# EAGLE design 130818_I_T_V_AriloRX_0_2 (EAGLE 6.1)
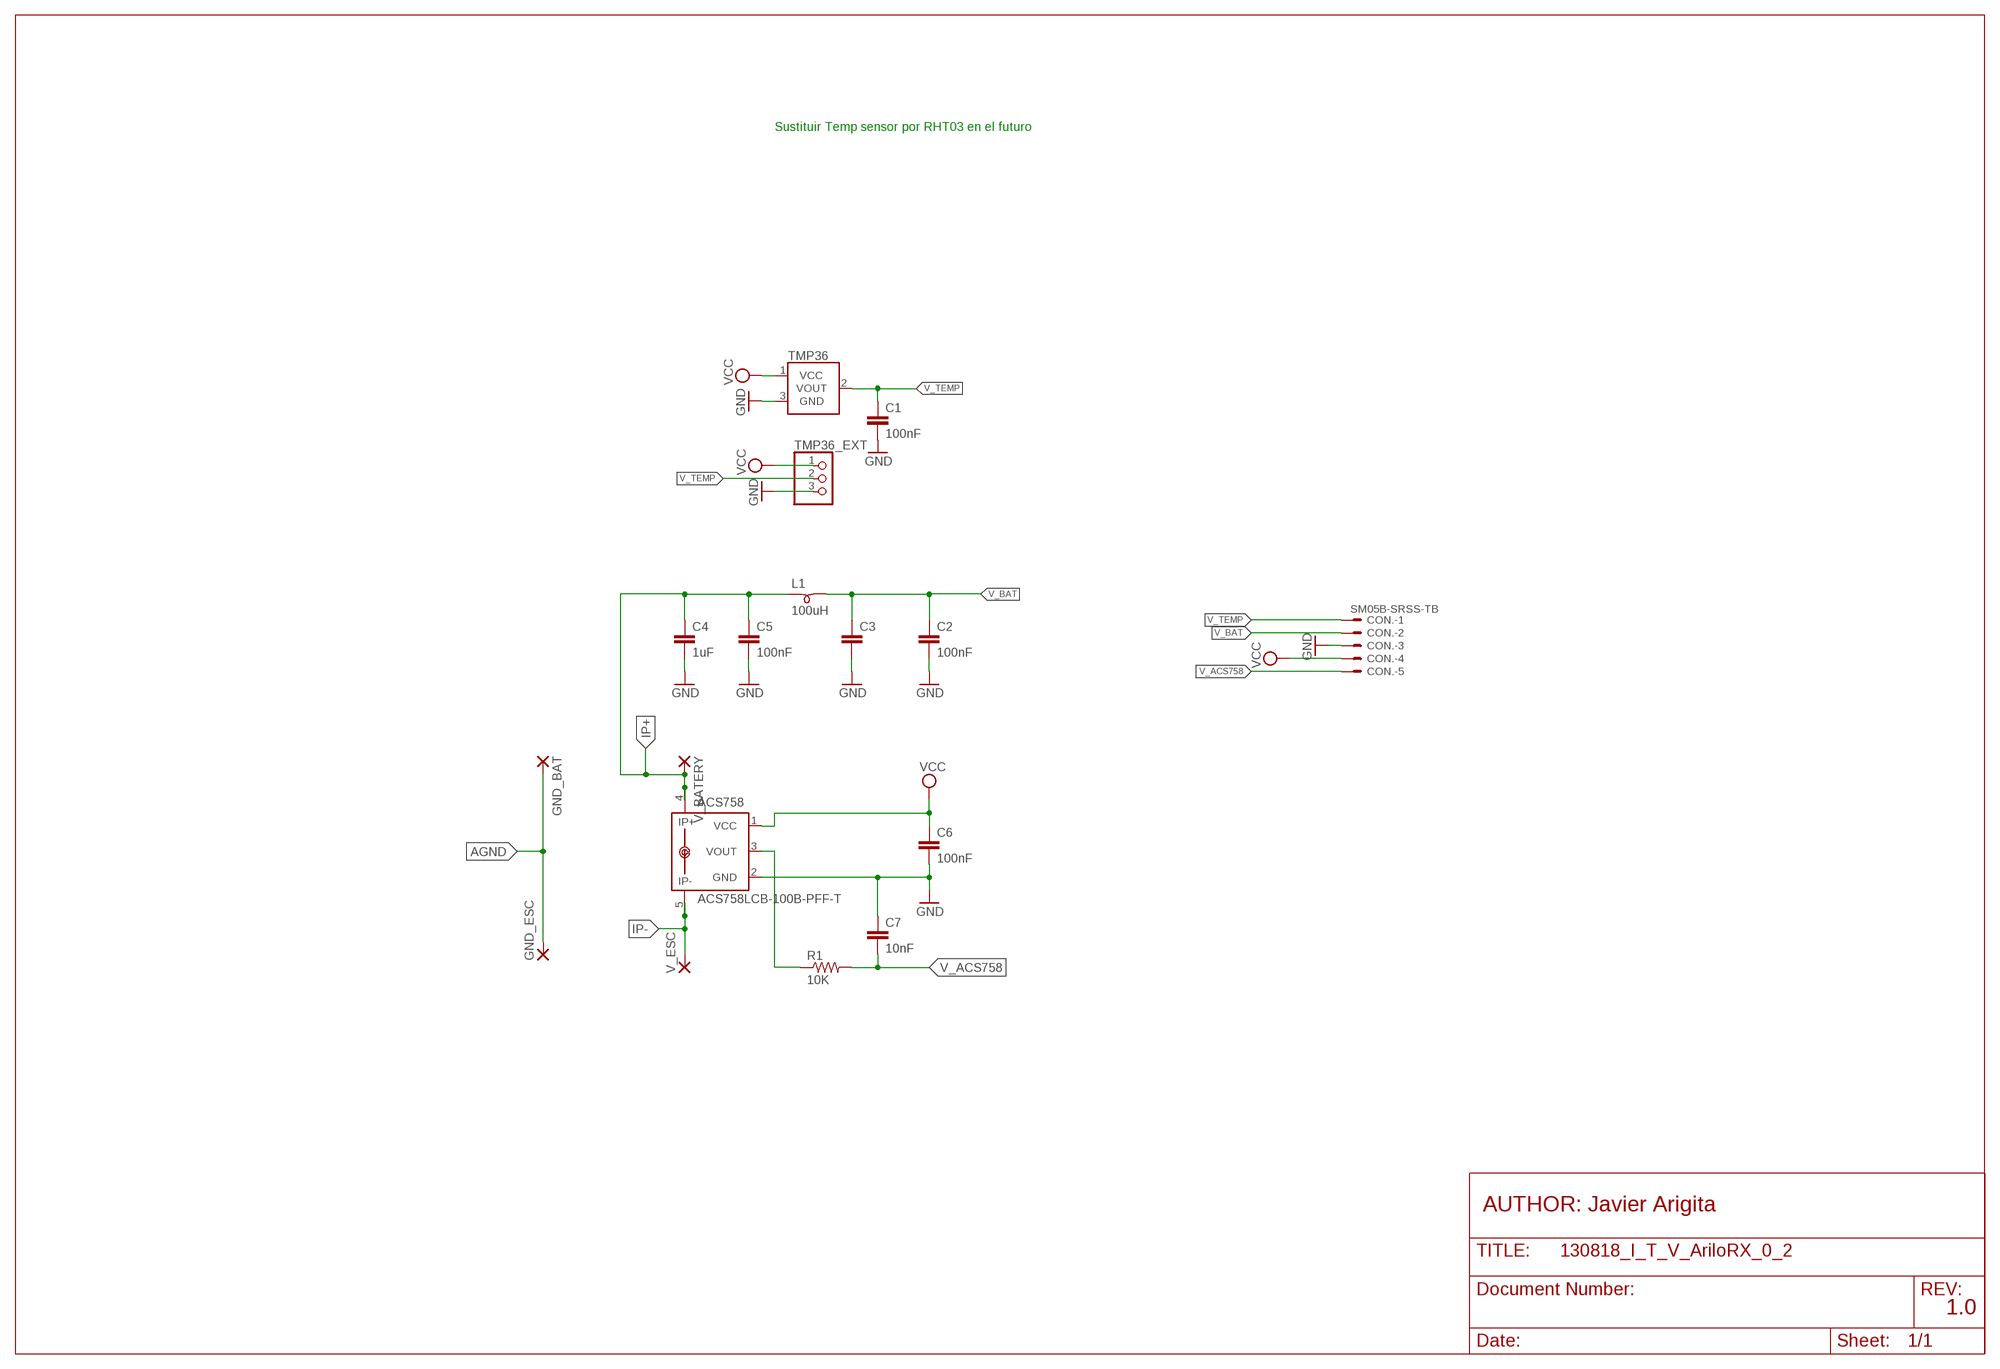
[diagram p0: schematic, sheet 1]

## Parts
ACS758  ACS758LCB-100B-PFF-T  [CB-PFF]
C1  100nF  C-EUC0805  [C0805]
C2  100nF  C-EUC0805  [C0805]
C3  C-EUC3216  [C3216]
C4  1uF  C-EUC3216  [C3216]
C5  100nF  C-EUC0805  [C0805]
C6  100nF  C-EUC0805  [C0805]
C7  10nF  C-EUC0805  [C0805]
CON.  SM05B-SRSS-TB  [SM05B-SRSS-TB]
GND_BAT  SMD5  [SMD2,54-5,08]
GND_ESC  SMD5  [SMD2,54-5,08]
L1  100uH  SM-B5  [SM-B5]
R1  10K  RESISTOR0805  [R0805]
TMP36  TMP36GT9  [TO-92]
TMP36_EXT  PINHD-1X3  [1X03]
V_BATERY  SMD5  [SMD2,54-5,08]
V_ESC  SMD5  [SMD2,54-5,08]

## Nets
AGND: GND_BAT.1(P) GND_ESC.1(P)
GND: ACS758.2(GND) C1.2 C2.2 C3.2 C4.2 C5.2 C6.2 C7.1 CON..3 TMP36.3(GND) TMP36_EXT.3
IP+: ACS758.4(IP+) ACS758.IP+1 C4.1 C5.1 L1.1 V_BATERY.1(P)
IP-: ACS758.5(IP-) ACS758.IP-1 V_ESC.1(P)
N$5: ACS758.3(VOUT) R1.1
V_ACS758: C7.2 CON..5 R1.2
V_BAT: C2.1 C3.1 CON..2 L1.2
V_TEMP: C1.1 CON..1 TMP36.2(VOUT) TMP36_EXT.2
VCC: ACS758.1(VCC) C6.1 CON..4 TMP36.1(VCC) TMP36_EXT.1

## Notes on the sheet
- Sustituir Temp sensor por RHT03 en el futuro
- AUTHOR: Javier Arigita
- 1.0

## Library data of the parts
ACS758 = allegro_ari:ACS758*: Thermally Enhanced, Fully Integrated, Hall Effect-Based Linear Current Sensor with 100 micro Ohm Current Conductor display layer 49 Reference in BRD and place VIAs on circles Source: http://www.allegromicro.com/en/Products/Part_Numbers/0758/0758.pdf; MPN: ACS758LCB-100B-PFF-T; OC_FARNELL: 1718998; OC_NEWARK: 04R7132
C1-C7 = rcl:C-EU: CAPACITOR, European symbol
CON. = con-jst2:?M05B-SRSS-TB: Disconnectable Crimp style connector, 1.0mm pitch 5 contacts
GND_BAT GND_ESC V_BATERY V_ESC = wirepad_ari:SMD5: SMD PAD
L1 = inductor-neosid:SM-B: INDUCTOR SMD Bead inductor; OC_FARNELL: unknown; OC_NEWARK: unknown
R1 = CEDT:RESISTOR
TMP36 = SparkFun-Sensors:TMP36: Precision degC temp sensor, analog out
TMP36_EXT = pinhead:PINHD-1X3: PIN HEADER

## Board
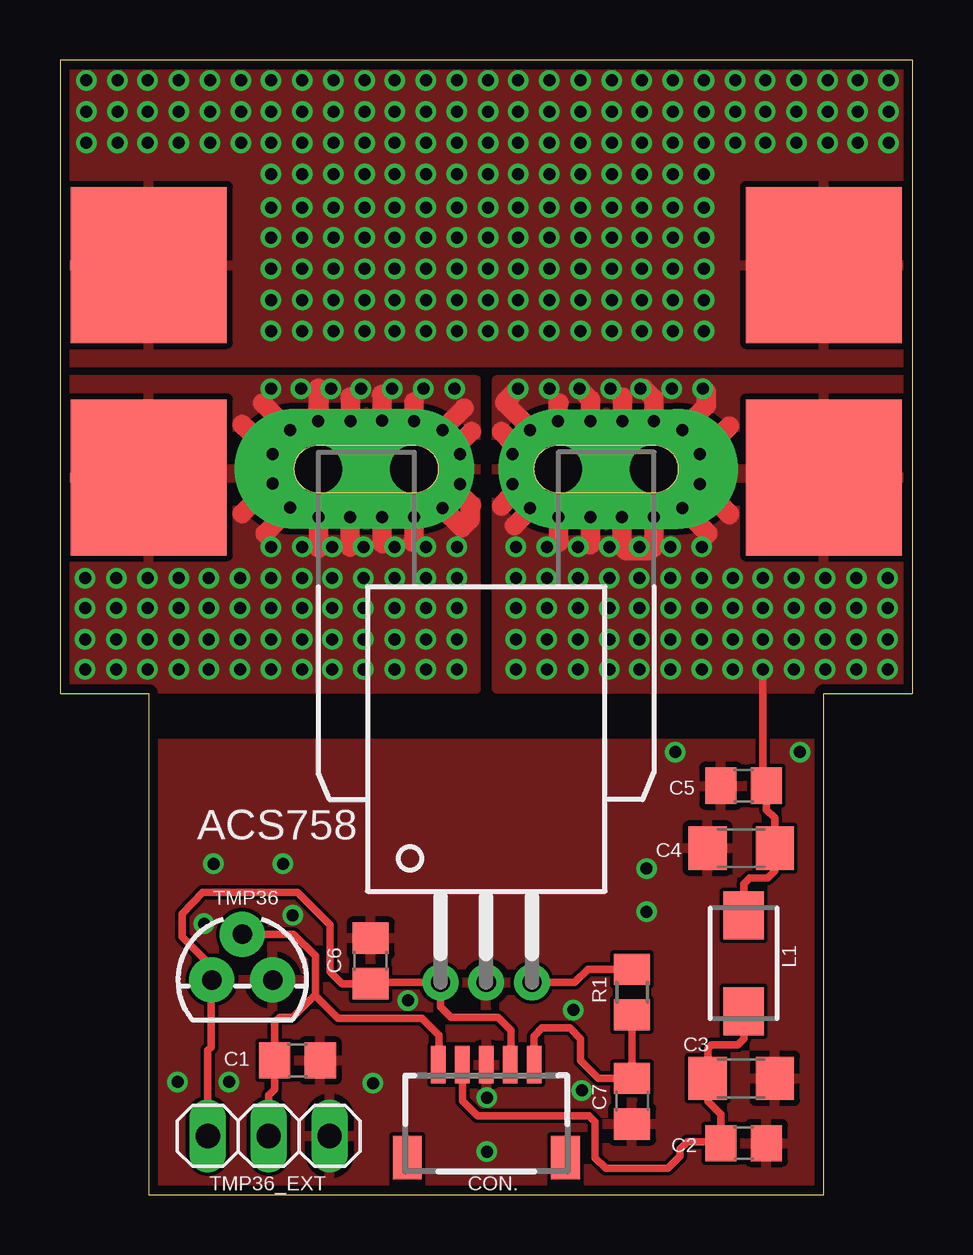
[diagram p1: board, top side]
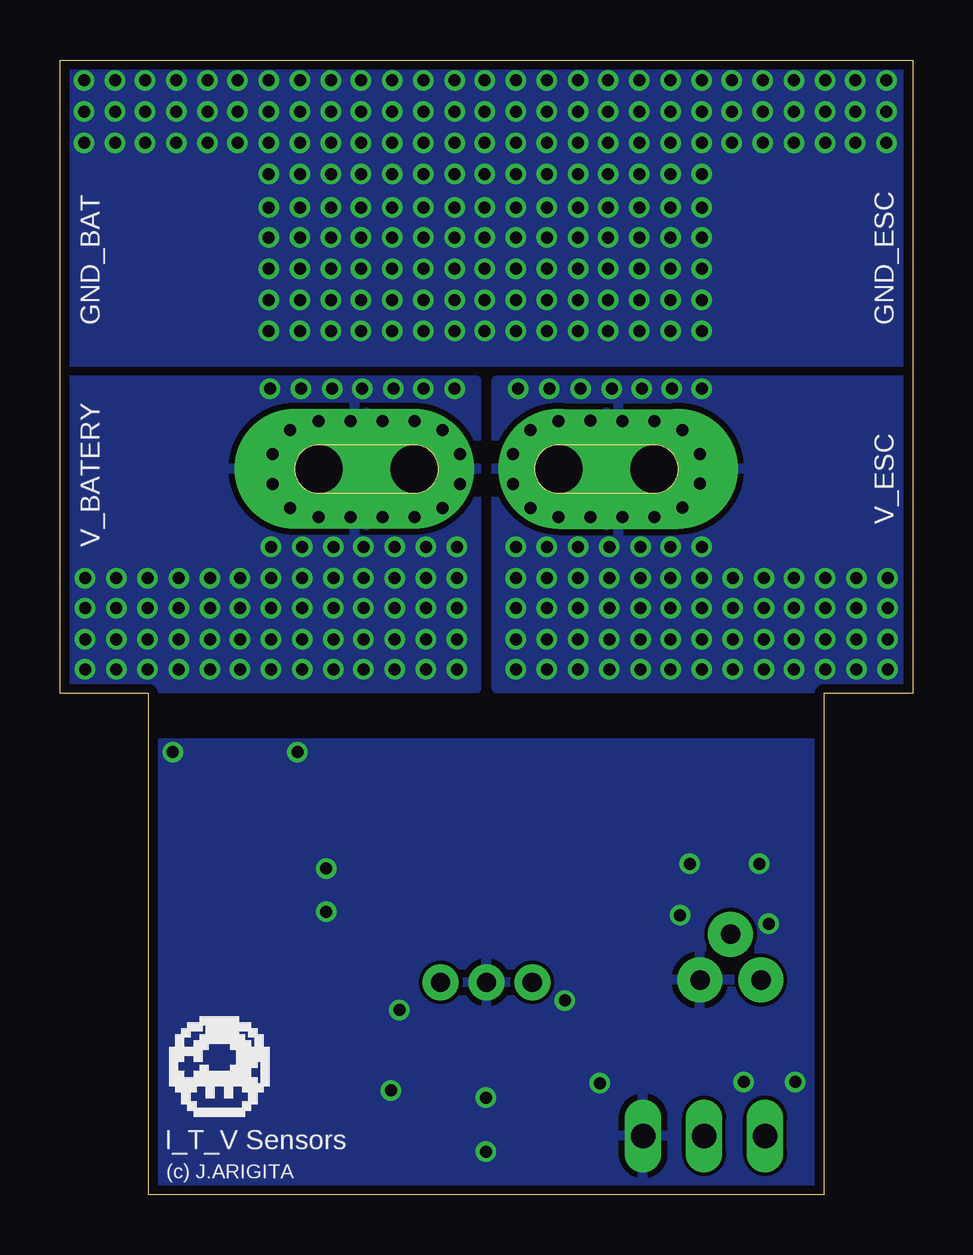
[diagram p2: board, bottom side, seen from below]

Size 35.55 x 47.3 mm. Coordinates in mm from the lower left corner, seen from the top.
Outline: 3.7,0 31.85,0 31.85,20.9 35.55,20.9 35.55,47.3 0,47.3 0,20.9 3.7,20.9 3.7,0
Copper layers (1*16): Top 0.0356mm / dielectric 1.5011mm / Bottom 0.0356mm
Design rules: minimum track width 6mil, minimum drill 13mil, track to track 6mil, track to pad 6mil, pad to pad 6mil, via to via 6mil, smd to smd 6mil, copper to edge 15mil, drill to drill 6mil, minimum pad ring 7mil, minimum via ring 7mil, stop-mask expansion 4mil, vias tented up to drill 0mil, thermal gap 10mil

### Footprints (pad centres in the part's own frame; a part is rotated, then mirrored left to right if it is on the bottom)
CB-PFF = drill 0.8 pad 1.5: 1 -1.91,-21.4; 2 0,-21.4; 3 1.91,-21.4 | drill 2 pad 5 offset: 4 3,0; 5 -3,0 | drill 2 pad 4 offset: IP+1 7,0; IP-1 -7,0
C0805 = smd 1.3 x 1.5: 1 -0.95,0; 2 0.95,0
C3216 = smd 1.6 x 1.8: 1 -1.4,0; 2 1.4,0
SM05B-SRSS-TB = smd 0.6 x 1.55: 1 -2,2.975; 2 -1,2.975; 3 0,2.975; 4 1,2.975; 5 2,2.975 | smd 1.2 x 1.8: FIT@1 -3.3,-0.9; FIT@2 3.3,-0.9
SMD2,54-5,08 = smd 6.5 x 6.5: 1 0,0
SM-B5 = smd 2 x 1.7: 1 -2,0; 2 2,0
R0805 = smd 1.3 x 1.5: 1 -0.95,0; 2 0.95,0
TO-92 = drill 0.813 pad 1.88: 1 -1.27,0; 2 0,1.905; 3 1.27,0
1X03 = drill 1.016 long: 1 -2.54,0; 2 0,0; 3 2.54,0

### Placement (x,y rotation side)
ACS758  17.77,30.25 0 top
C1  9.9,5.6 0 top
C2  28.5,2.15 0 top
C3  28.4,4.85 0 top
C4  28.4,14.45 180 top
C5  28.5,17.05 180 top
C6  12.95,9.75 90 top
C7  23.85,3.9 90 top
CON.  17.77,2.45 0 top
GND_BAT  31.85,38.75 0 top
GND_ESC  3.7,38.75 0 top
L1  28.5,9.65 270 top
R1  23.85,8.45 270 top
TMP36  7.6,8.95 0 top
TMP36_EXT  8.7,2.45 0 top
V_BATERY  31.85,29.9 0 top
V_ESC  3.7,29.9 0 top

### Tracks (layer width: path | path; a pad name or v marks a point on that pad's centre or on a via)
AGND  (via drill 0.5)
  other vias: 1.1,46.45 1.1,45.15 1.1,43.85 2.4,46.45 2.4,45.15 2.4,43.85 3.65,46.45 3.65,45.15 3.65,43.85 4.95,46.45 4.95,45.15 4.95,43.85 6.25,46.45 6.25,45.15 6.25,43.85 7.55,46.45 7.55,45.15 7.55,43.85 8.8,46.45 8.8,45.15 8.8,43.85 8.8,42.55 8.8,41.15 10.1,46.45 10.1,45.15 10.1,43.85 10.1,42.55 10.1,41.15 11.4,46.45 11.4,45.15 11.4,43.85 11.4,42.55 11.4,41.15 12.7,46.45 12.7,45.15 12.7,43.85 12.7,42.55 12.7,41.15 13.95,46.45 13.95,45.15 13.95,43.85 13.95,42.55 13.95,41.15 15.25,46.45 15.25,45.15 15.25,43.85 15.25,42.55 15.25,41.15 16.55,46.45 16.55,45.15 16.55,43.85 16.55,42.55 16.55,41.15 17.85,46.45 17.85,45.15 17.85,43.85 17.85,42.55 17.85,41.15 19.1,46.45 19.1,45.15 19.1,43.85 19.1,42.55 19.1,41.15 20.4,46.45 20.4,45.15 20.4,43.85 20.4,42.55 20.4,41.15 21.7,46.45 21.7,45.15 21.7,43.85 21.7,42.55 21.7,41.15 23,46.45 23,45.15 23,43.85 23,42.55 23,41.15 24.25,46.45 24.25,45.15 24.25,43.85 24.25,42.55 24.25,41.15 25.55,46.45 25.55,45.15 25.55,43.85 25.55,42.55 25.55,41.15 26.85,46.45 26.85,45.15 26.85,43.85 26.85,42.55 26.85,41.15 28.15,46.45 28.15,45.15 28.15,43.85 29.4,46.45 29.4,45.15 29.4,43.85 30.7,46.45 30.7,45.15 30.7,43.85 8.8,39.9 8.8,38.6 8.8,37.3 8.8,36 10.1,39.9 10.1,38.6 10.1,37.3 10.1,36 11.4,39.9 11.4,38.6 11.4,37.3 11.4,36 12.7,39.9 12.7,38.6 12.7,37.3 12.7,36 13.95,39.9 13.95,38.6 13.95,37.3 13.95,36 15.25,39.9 15.25,38.6 15.25,37.3 15.25,36 16.55,39.9 16.55,38.6 16.55,37.3 16.55,36 17.85,39.9 17.85,38.6 17.85,37.3 17.85,36 19.1,39.9 19.1,38.6 19.1,37.3 19.1,36 20.4,39.9 20.4,38.6 20.4,37.3 20.4,36 21.7,39.9 21.7,38.6 21.7,37.3 21.7,36 23,39.9 23,38.6 23,37.3 23,36 24.25,39.9 24.25,38.6 24.25,37.3 24.25,36 25.55,39.9 25.55,38.6 25.55,37.3 25.55,36 26.85,39.9 26.85,38.6 26.85,37.3 26.85,36 32,46.45 32,45.15 32,43.85 33.25,46.45 33.25,45.15 33.25,43.85 34.55,46.45 34.55,45.15 34.55,43.85
  pour Top: 0.2,34.7 35.35,34.7 35.35,47.1 0.2,47.1
  pour Bottom: 0.2,34.7 35.35,34.7 35.35,47.1 0.2,47.1
GND  (via drill 0.5)
  other vias: 7.05,4.7 9.7,11.65 6,11.3 14.5,8.1 21.4,7.7 4.9,4.7 13.05,4.65 17.8,1.8 6.4,13.8 9.3,13.8 17.8,4.05 21.75,4.35 24.45,13.6 25.65,18.45 30.85,18.45 24.45,11.8
  pour Top: 31.7,0.2 3.9,0.2 3.9,18.8 31.7,18.8
  pour Bottom: 31.7,0.2 3.9,0.2 3.9,18.8 31.7,18.8
IP+  (via drill 0.5)
  Top 0.305: v29.3,21.9 29.3,17.05 C5.1 29.45,16.05 29.8,15.7 C4.1 29.8,13.5 29.5,13.2 28.75,13.2 28.5,12.95 L1.1
  Top 0.813: v18.87,30.87 18.87,31.33 18.4,31.8 | v18.87,29.63 18.87,29.22 18.4,28.7 | v20.77,32.25 20.77,32.97 20.8,33 | v22.11,32.25 22.11,33.14 v21.65,33.6 | v23.44,32.25 23.44,33.24 23.45,33.25 | v24.77,32.25 24.77,33.18 24.35,33.6 v24.2,33.6 | v25.95,31.88 25.95,31.9 26.95,32.9 26.95,33.45 v26.8,33.6 | 27.9,32.05 26.68,30.83 v26.68,29.63 26.68,29.57 27.9,28.35 27.9,28.4 27.67,28.63 | v25.95,28.63 25.95,28.59 27,27.55 | v23.43,28.25 23.43,27.29 23.4,27.25 23.4,27.05 23.6,26.85 24.6,26.85 24.75,27 24.75,28.23 v24.77,28.25 | v22.11,28.25 22.11,27.11 22.1,27.1 | v20.77,28.25 20.77,27.23 20.8,27.2 | v19.59,28.63 19.59,28.55 18.95,27.9 | v19.6,31.88 19.6,31.95 18.55,33 18.55,33.05 v19.1,33.6
  other vias: 26.68,30.87 19,27 20.3,27 21.6,27 22.9,27 24.15,27 25.45,27 26.75,27 19,25.7 20.3,25.7 21.6,25.7 22.9,25.7 24.15,25.7 25.45,25.7 26.75,25.7 28.05,25.7 29.3,25.7 30.6,25.7 31.9,25.7 33.2,25.7 34.5,25.7 19,24.45 20.3,24.45 21.6,24.45 22.9,24.45 24.15,24.45 25.45,24.45 26.75,24.45 28.05,24.45 29.3,24.45 30.6,24.45 31.9,24.45 33.2,24.45 34.5,24.45 19,23.15 20.3,23.15 21.6,23.15 22.9,23.15 24.15,23.15 25.45,23.15 26.75,23.15 28.05,23.15 29.3,23.15 30.6,23.15 31.9,23.15 33.2,23.15 34.5,23.15 19,21.9 20.3,21.9 21.6,21.9 22.9,21.9 24.15,21.9 25.45,21.9 26.75,21.9 28.05,21.9 30.6,21.9 31.9,21.9 33.2,21.9 34.5,21.9 20.4,33.6 22.95,33.6 25.5,33.6
  pour Top: 35.35,21.1 35.35,33.95 18.2,33.95 18.2,21.1
  pour Bottom: 35.35,21.1 35.35,33.95 18.2,33.95 18.2,21.1
IP-  (via drill 0.5)
  Top 0.813: 16.6,30.9 16.7,30.85 16.7,29.2 | 16.6,30.9 16.65,29.7 | v10.77,32.25 10.75,32.25 10.75,33.6 10.8,33.6 10.8,32.3 | v9.59,31.88 9.57,31.88 8.45,33 | v8.87,30.87 8.87,30.93 7.6,32.1 | v8.87,29.64 8.84,29.64 7.6,28.4 | v9.59,28.64 9.59,28.59 8.55,27.55 | v10.78,28.25 10.78,26.98 10.8,26.95 | v13.43,28.25 13.43,27.16 13.45,27.15 | v14.77,28.25 14.77,27.27 14.7,27.2 | v15.94,28.63 15.94,28.61 16.75,27.8 17.1,28.15 17.1,28.75 16.7,29.15 16.7,29.2 | 16.7,29.2 17.15,28.75 | 16.6,30.9 16.6,31.25 17.15,31.8 | v15.95,31.87 15.95,31.89 16.85,32.8 | v13.43,32.26 13.43,33.31 13.4,33.35 | v12.11,32.24 12.11,33.24 12.1,33.25 | v12.1,28.25 12.1,27 | v14.77,32.26 14.77,33.03 14.75,33.05
  other vias: 16.68,30.88 16.68,29.63 8.8,33.6 10.05,33.6 11.3,33.6 12.55,33.6 13.85,33.6 15.15,33.6 16.45,33.6 8.8,27 10.1,27 11.35,27 12.65,27 13.95,27 15.25,27 16.55,27 1.05,25.7 2.35,25.7 3.65,25.7 4.95,25.7 6.2,25.7 7.5,25.7 8.8,25.7 10.1,25.7 11.35,25.7 12.65,25.7 13.95,25.7 15.25,25.7 16.55,25.7 1.05,24.45 2.35,24.45 3.65,24.45 4.95,24.45 6.2,24.45 7.5,24.45 8.8,24.45 10.1,24.45 11.35,24.45 12.65,24.45 13.95,24.45 15.25,24.45 16.55,24.45 1.05,23.15 2.35,23.15 3.65,23.15 4.95,23.15 6.2,23.15 7.5,23.15 8.8,23.15 10.1,23.15 11.35,23.15 12.65,23.15 13.95,23.15 15.25,23.15 16.55,23.15 1.05,21.9 2.35,21.9 3.65,21.9 4.95,21.9 6.2,21.9 7.5,21.9 8.8,21.9 10.1,21.9 11.35,21.9 12.65,21.9 13.95,21.9 15.25,21.9 16.55,21.9
  pour Bottom: 0.2,21.1 17.35,21.1 17.35,33.95 0.2,33.95
  pour Top: 0.2,21.1 17.35,21.1 17.35,33.95 0.2,33.95
N$5
  Top 0.305: ACS758.3 21.45,8.85 22,9.4 R1.1
V_ACS758
  Top 0.305: R1.2 C7.2 22.45,4.85 21.7,5.6 21.7,6.5 21.25,6.95 20.1,6.95 19.75,6.6 19.75,5.45 CON..5
V_BAT
  Top 0.305: L1.2 28.5,6.5 28.25,6.25 27.15,6.25 27,6.1 C3.1 27,3.9 27.55,3.35 C2.1 27.5,2.2 26.15,2.2 25.85,1.9 25.85,1.6 25.35,1.1 22.75,1.1 22.3,1.55 22.3,3.05 22.05,3.3 17.4,3.3 16.77,3.92 CON..2
V_TEMP
  Top 0.305: TMP36.2 9.75,10.86 10.65,9.95 10.65,8.35 | 10.65,8.35 9.7,7.4 9.15,7.4 8.95,7.2 C1.1 8.95,4.4 8.7,4.15 TMP36_EXT.2 | 10.65,8.35 10.65,8.3 11.6,7.35 15.1,7.35 15.8,6.65 15.8,5.45 CON..1
VCC
  Top 0.305: CON..4 18.8,5.45 18.8,6.85 18.25,7.4 16.3,7.4 15.86,7.84 ACS758.1 13,8.85 C6.1 11.75,8.8 11.25,9.3 11.25,11.25 9.9,12.6 5.95,12.6 5.1,11.7 5.1,10.75 6.33,9.52 TMP36.1 6.3,8.92 6.3,6.15 6.16,6.01 TMP36_EXT.1

### Text on the board
bPlace: I_T_V Sensors | (c) J.ARIGITA